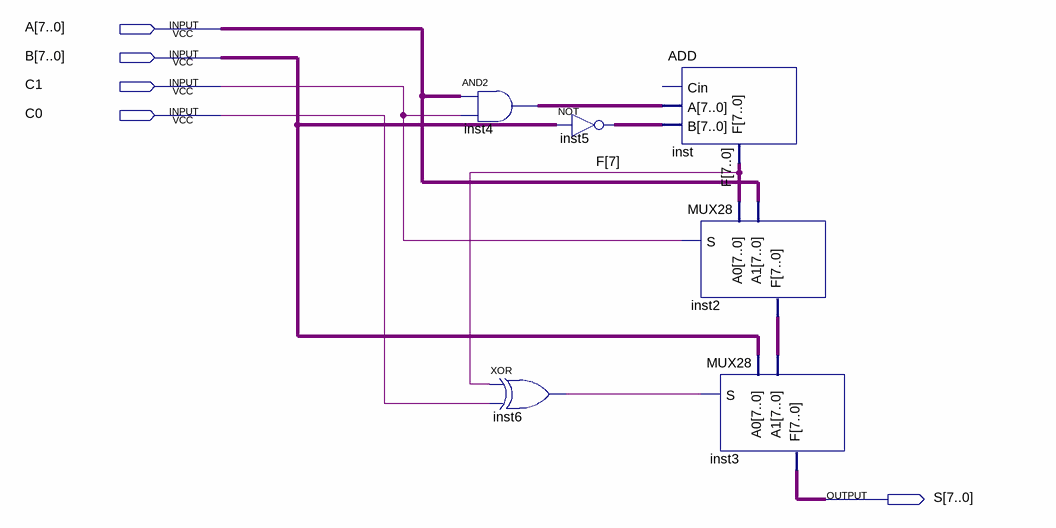
[diagram p0: schematic sheet]
// Quartus schematic ABS_MIN_MAX.bdf as structural Verilog: 6 symbols, 5 pins
module ABS_MIN_MAX (
  input  [7:0] A,
  input  [7:0] B,
  input  C1,
  input  C0,
  output [7:0] S
);

  wire inst6_out;
  wire [7:0] F, inst2_f, inst4_out, inst5_out;

  assign inst4_out = A & {8{C1}};  // AND2 inst4, 8 bits wide
  xor inst6 (inst6_out, F[7], C0);
  assign inst5_out = ~B;  // NOT inst5, 8 bits wide
  ADD inst (.A(inst4_out), .B(inst5_out), .F(F));  // open: Cin
  MUX28 inst2 (.S(C1), .A0(F), .A1(A), .F(inst2_f));
  MUX28 inst3 (.S(inst6_out), .A0(B), .A1(inst2_f), .F(S));
endmodule
